# EAGLE schematic Proyecto final - Esquema (EAGLE 9.7.0)
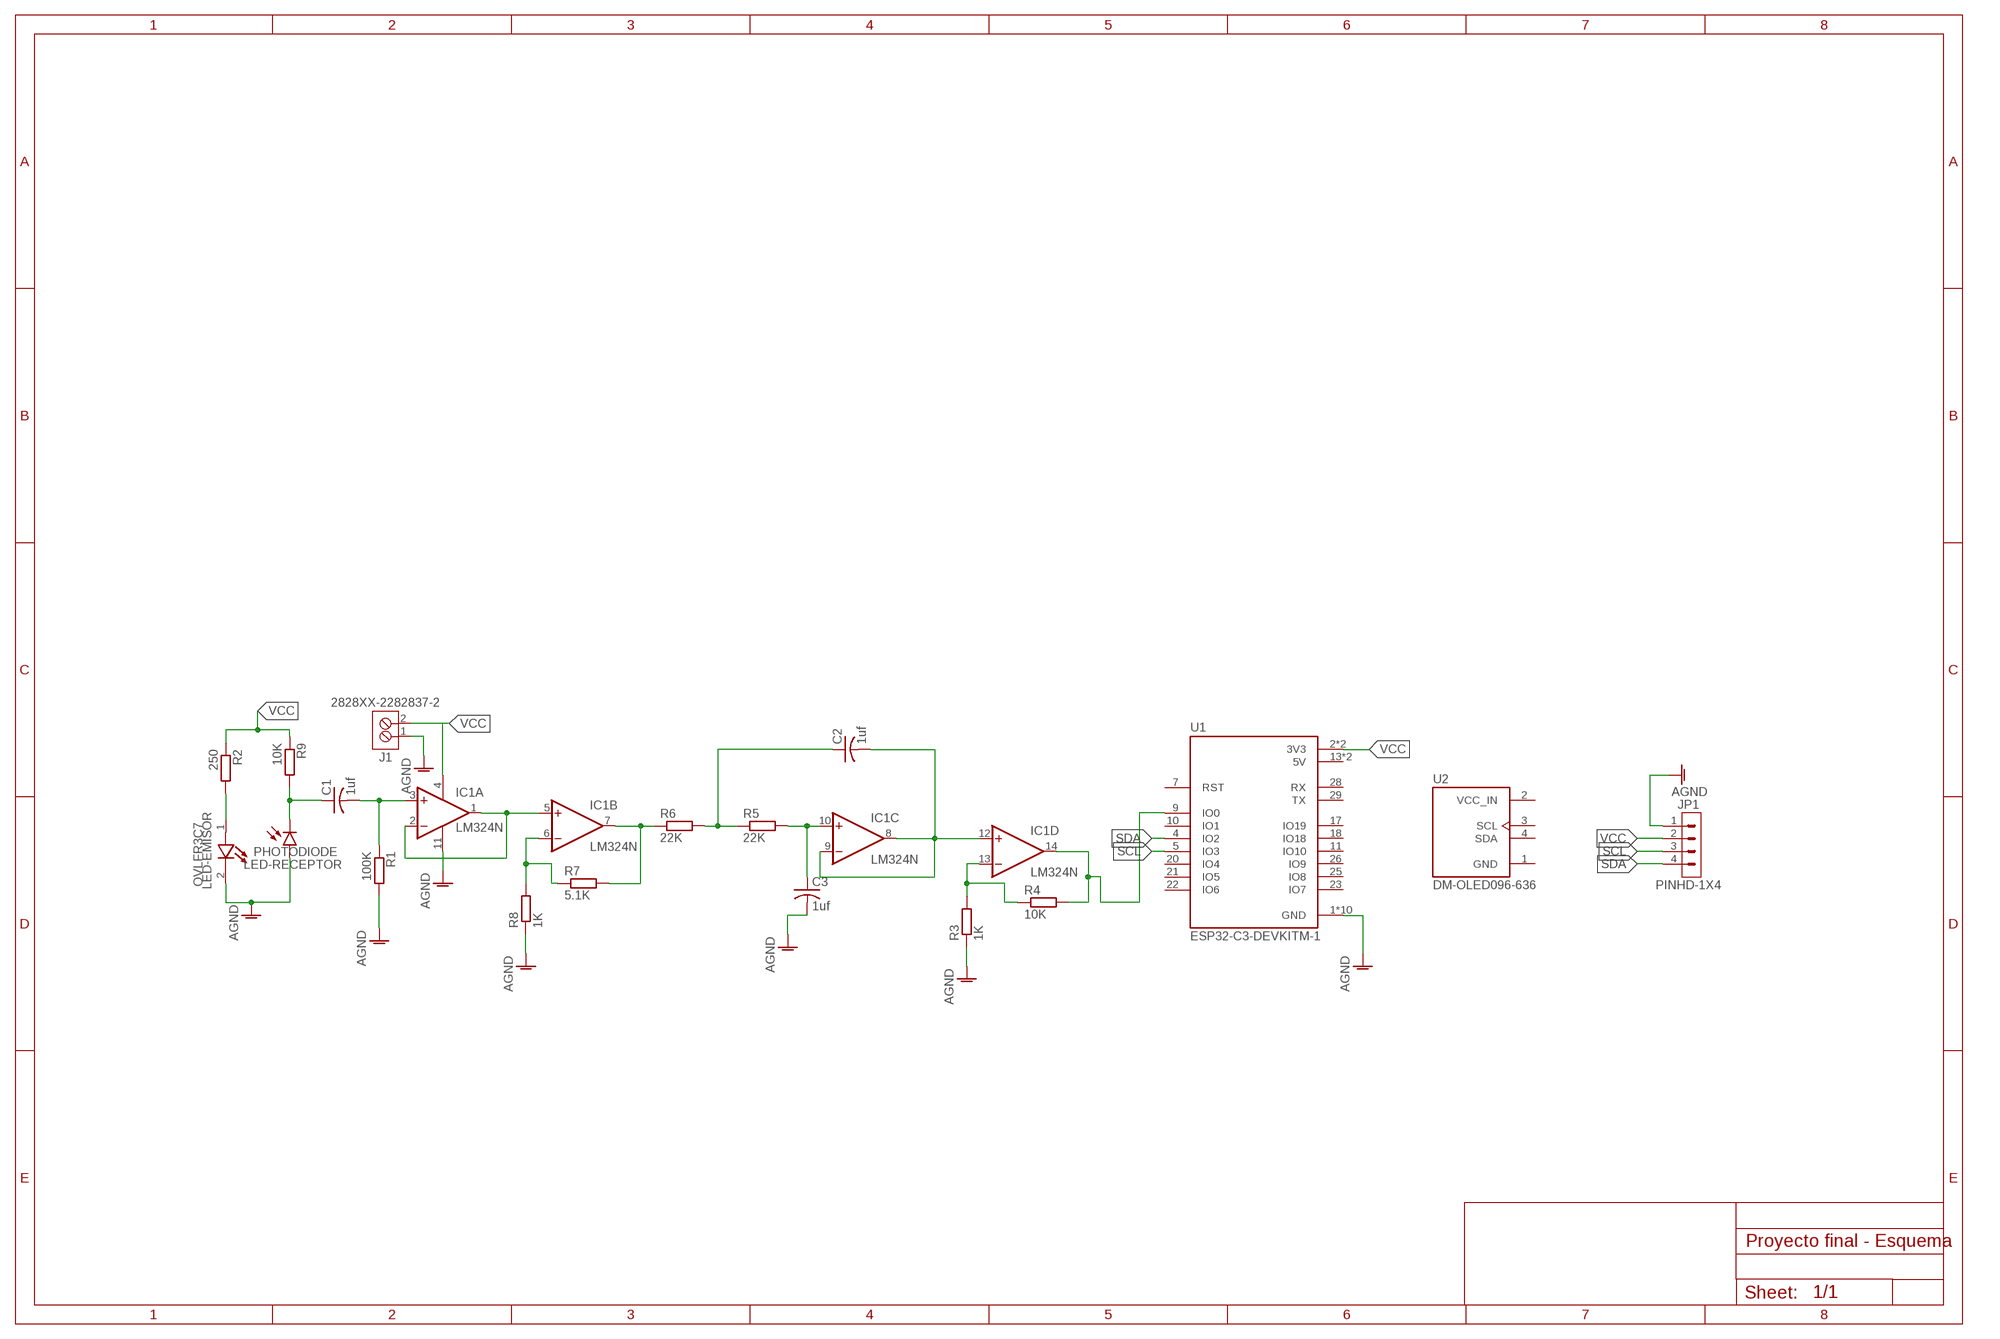
[diagram p0: schematic, sheet 1]

## Parts
C1  1uf  C-US025-024X044  [C025-024X044]
C2  1uf  C-US025-024X044  [C025-024X044]
C3  1uf  C-US025-024X044  [C025-024X044]
IC1  LM324N  [DIL14]
J1  2828XX-2282837-2  [TERMBLK_508-2N]
JP1  PINHD-1X4  [1X04]
LED-EMISOR  OVLFR3C7  [LEDRD254W51D580H870]
LED-RECEPTOR  PHOTODIODE  [LEDRD254W51D580H541B]
R1  100K  R-EU_0207/10  [0207/10]
R2  250  R-EU_0207/10  [0207/10]
R3  1K  R-EU_0207/10  [0207/10]
R4  10K  R-EU_0207/10  [0207/10]
R5  22K  R-EU_0207/10  [0207/10]
R6  22K  R-EU_0207/10  [0207/10]
R7  5.1K  R-EU_0207/10  [0207/10]
R8  1K  R-EU_0207/10  [0207/10]
R9  10K  R-EU_0207/10  [0207/10]
U1  ESP32-C3-DEVKITM-1  [XCVR_ESP32-C3-DEVKITM-1]
U2  DM-OLED096-636  [MODULE_DM-OLED096-636]

## Nets
AGND: C3.2 IC1.11(P:V-) J1.1 JP1.1 LED-EMISOR.2(C) LED-RECEPTOR.A R1.2 R3.1 R8.1 U1.1(GND) U1.6(GND) U1.8(GND) U1.12(GND) U1.15(GND) U1.16(GND) U1.19(GND) U1.24(GND) U1.27(GND) U1.30(GND)
N$1: IC1.1(A:OUT) IC1.2(A:-IN) IC1.5(B:+IN)
N$2: IC1.6(B:-IN) R7.1 R8.2
N$3: IC1.7(B:OUT) R6.1 R7.2
N$4: C2.1 R5.1 R6.2
N$5: C3.1 IC1.10(C:+IN) R5.2
N$6: J1.2
N$7: IC1.14(D:OUT) R4.2 U1.9(IO0)
N$8: IC1.13(D:-IN) R3.2 R4.1
N$9: C1.2 IC1.3(A:+IN) R1.1
N$10: LED-EMISOR.1(A) R2.2
N$11: C1.1 LED-RECEPTOR.C R9.2
N$12: C2.2 IC1.8(C:OUT) IC1.9(C:-IN) IC1.12(D:+IN)
SCL: JP1.3 U1.5(IO3)
SDA: JP1.4 U1.4(IO2)
VCC: IC1.4(P:V+) JP1.2 R2.1 R9.1 U1.2(3V3) U1.3(3V3)
Unconnected: U1.7(RST) U1.10(IO1) U1.11(IO10) U1.17(IO19) U1.18(IO18) U1.20(IO4) U1.21(IO5) U1.22(IO6) U1.23(IO7) U1.25(IO8) U1.26(IO9) U1.28(RX) U1.29(TX) U2.3(SCL) U2.4(SDA)

## Power pins joined to a net without a drawn wire
5V: U1.13(5V) U1.14(5V)
GND: U2.1(GND)
VCC_IN: U2.2(VCC_IN)

## Library data of the parts
C1-C3 = BeagleBone_Black_Wireless:C-US: CAPACITOR, American symbol
IC1 = linear:LM324: OP AMP
J1 = Connector:2828XX-2: 2 Position Wire to Board Terminal Block Horizontal with Board
JP1 = Connector:PINHD-1X4: Pin Header
LED-EMISOR = OVLFR3C7:OVLFR3C7: Check availability <https://pricing.snapeda.com/parts/OVLFR3C7/TT%20Electronics/Optek%20Technology/view-part?ref=eda>
LED-RECEPTOR = Tinkercad:PHOTODIODE: Photodiode Reference Datasheet <https://datasheet.octopart.com/PDB-C139-Advanced-Photonix-datasheet-146011.pdf>
R1-R9 = rcl:R-EU_: RESISTOR, European symbol
U1 = ESP32-C3-DEVKITM-1:ESP32-C3-DEVKITM-1: Check availability <https://pricing.snapeda.com/parts/ESP32-C3-DEVKITM-1/Espressif%20Systems/view-part?ref=eda>
U2 = DM-OLED096-636:DM-OLED096-636: Check availability <https://pricing.snapeda.com/parts/DM-OLED096-636/Display%20Module/view-part?ref=eda>